# Altium schematic sheet Motor.SchDoc
size A
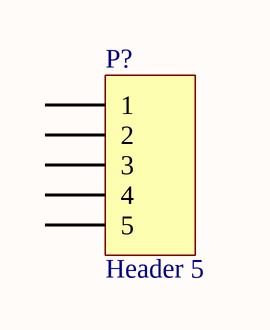
[diagram p0: Motor.SchDoc]

## Parts
P?  Header 5  [HDR1X5A]

## Nets

Not connected (* = marked no-connect by the designer): P? 1 2 3 4 5

## Library data of the parts
P? = Header 5: Header, 5-Pin; LatestRevisionDate: 17-Jul-2002; LatestRevisionNote: Re-released for DXP Platform.; Publisher: Altium Limited